# Altium schematic sheet RFCU_V2.0.SchDoc
size A4
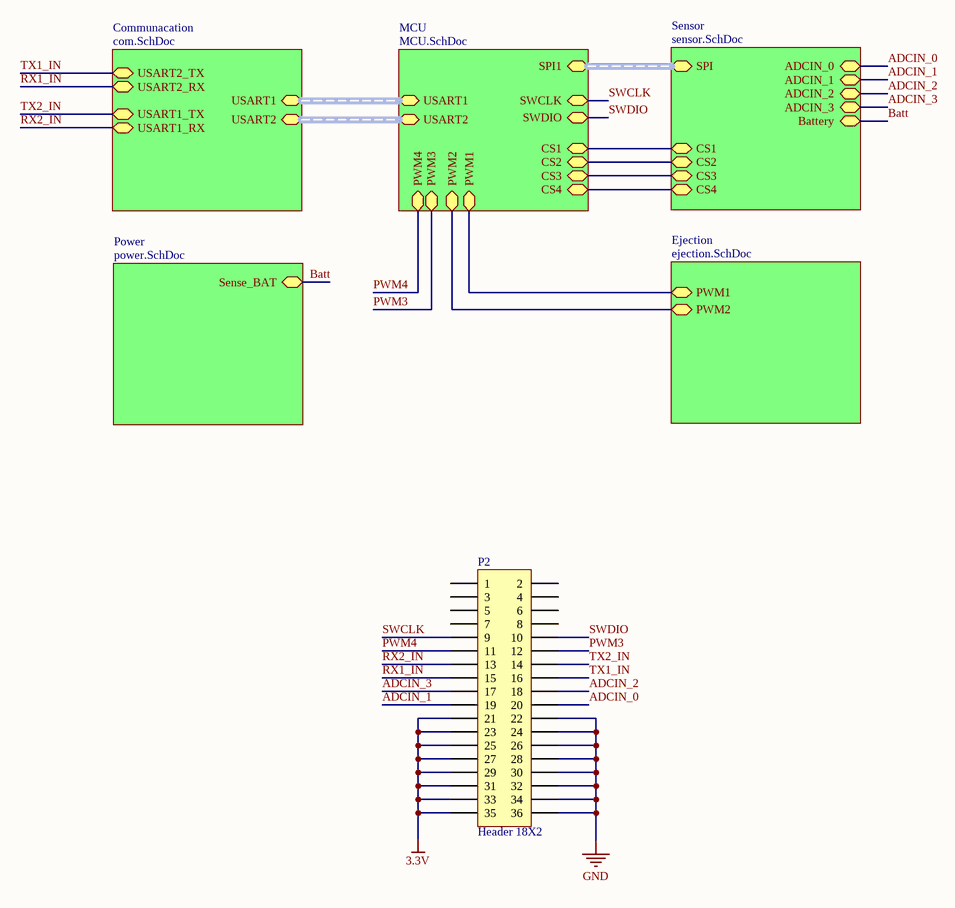
[diagram p0: RFCU_V2.0.SchDoc]

## Parts
P2  Header 18X2  [2X18 2.54mm Headers]

## Sub-sheets
Communacation = com.SchDoc: USART1 (harness USART), USART2 (harness USART), USART2_RX, USART2_TX, USART1_TX, USART1_RX
Ejection = ejection.SchDoc: PWM2, PWM1
MCU = MCU.SchDoc: USART1 (harness USART), USART2 (harness USART), SPI1 (harness SPI), PWM3, PWM4, PWM2, PWM1, SWCLK, SWDIO, CS4, CS3, CS1, CS2
Power = power.SchDoc: Sense_BAT
Sensor = sensor.SchDoc: SPI (harness SPI), ADCIN_2, ADCIN_1, ADCIN_3, ADCIN_0, Battery, CS2, CS1, CS4, CS3

## Nets
3.3V: P2.21 P2.23 P2.25 P2.27 P2.29 P2.31 P2.33 P2.35
GND: P2.22 P2.24 P2.26 P2.28 P2.30 P2.32 P2.34 P2.36
ADCIN_0: P2.20 ; sheet Sensor/ADCIN_0
ADCIN_1: P2.19 ; sheet Sensor/ADCIN_1
ADCIN_2: P2.18 ; sheet Sensor/ADCIN_2
ADCIN_3: P2.17 ; sheet Sensor/ADCIN_3
Batt: sheet Power/Sense_BAT, sheet Sensor/Battery
PWM3: P2.12 ; sheet MCU/PWM3
PWM4: P2.11 ; sheet MCU/PWM4
RX1_IN: P2.15 ; sheet Communacation/USART2_RX
RX2_IN: P2.13 ; sheet Communacation/USART1_RX
SWCLK: P2.9 ; sheet MCU/SWCLK
SWDIO: P2.10 ; sheet MCU/SWDIO
TX1_IN: P2.16 ; sheet Communacation/USART2_TX
TX2_IN: P2.14 ; sheet Communacation/USART1_TX
(unnamed): sheet MCU/PWM2, sheet Ejection/PWM2
(unnamed): sheet MCU/PWM1, sheet Ejection/PWM1
(unnamed): sheet MCU/CS4, sheet Sensor/CS4
(unnamed): sheet MCU/CS3, sheet Sensor/CS3
(unnamed): sheet MCU/CS1, sheet Sensor/CS1
(unnamed): sheet MCU/CS2, sheet Sensor/CS2

Not connected (* = marked no-connect by the designer): P2 1 2 3 4 5 6 7 8

## Buses and harness runs
harness sheet Communacation/USART1 = sheet MCU/USART1
harness sheet Communacation/USART2 = sheet MCU/USART2
harness sheet MCU/SPI1 = sheet Sensor/SPI

## Library data of the parts
P2 = Header 18X2: Header, 18-Pin, Dual row; LatestRevisionDate: 17-Jul-2002; LatestRevisionNote: Re-released for DXP Platform.; Publisher: Altium Limited